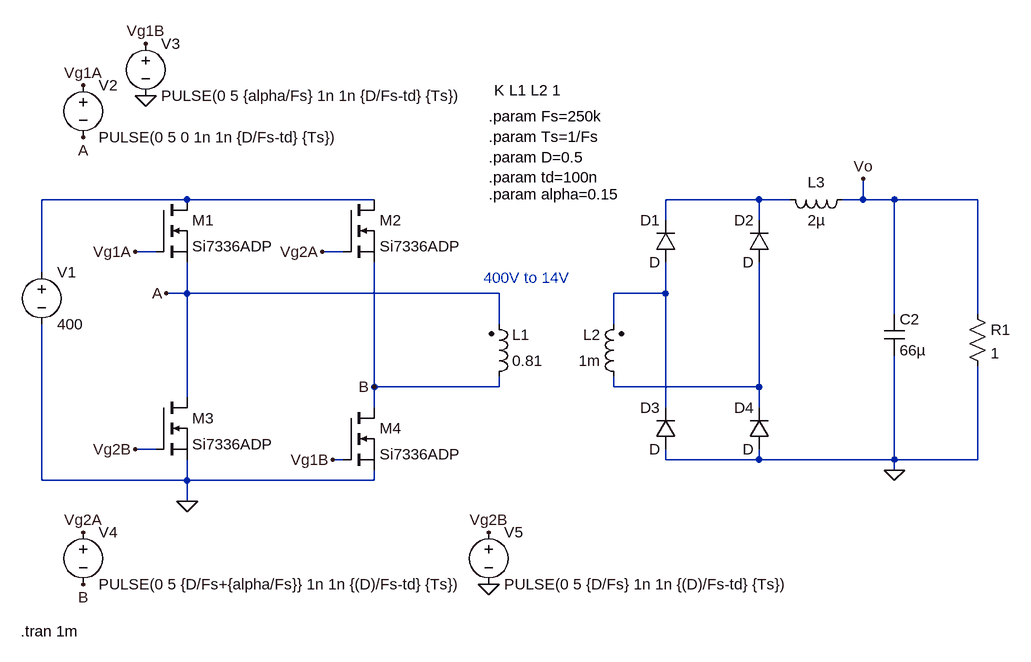
[diagram p0: schematic PSFB.asc]
PSFB.asc, the LTspice schematic file:
Version 4
SHEET 1 1024 680
WIRE -464 -64 -688 -64
WIRE -176 -64 -464 -64
WIRE 416 -64 272 -64
WIRE 464 -64 416 -64
WIRE 576 -64 576 -96
WIRE 576 -64 544 -64
WIRE 624 -64 576 -64
WIRE 752 -64 624 -64
WIRE 272 -32 272 -64
WIRE 416 -32 416 -64
WIRE -512 16 -544 16
WIRE -224 16 -256 16
WIRE -688 48 -688 -64
WIRE -464 80 -464 32
WIRE -464 80 -496 80
WIRE 16 80 -464 80
WIRE 272 80 272 32
WIRE 272 80 192 80
WIRE 624 112 624 -64
WIRE 752 112 752 -64
WIRE 16 128 16 80
WIRE 192 128 192 80
WIRE -176 224 -176 32
WIRE 16 224 16 208
WIRE 16 224 -176 224
WIRE 192 224 192 208
WIRE 416 224 416 32
WIRE 416 224 192 224
WIRE -464 240 -464 80
WIRE -176 256 -176 224
WIRE 272 256 272 80
WIRE 416 256 416 224
WIRE -512 320 -544 320
WIRE -224 336 -240 336
WIRE 272 336 272 320
WIRE 416 336 416 320
WIRE 416 336 272 336
WIRE 624 336 624 176
WIRE 624 336 416 336
WIRE 752 336 752 192
WIRE 752 336 624 336
WIRE 624 352 624 336
WIRE -688 368 -688 128
WIRE -464 368 -464 336
WIRE -464 368 -688 368
WIRE -176 368 -176 352
WIRE -176 368 -464 368
WIRE -464 400 -464 368
FLAG 576 -96 Vo
FLAG 624 352 0
FLAG -496 80 A
FLAG -176 224 B
FLAG -544 16 Vg1A
FLAG -240 336 Vg1B
FLAG -256 16 Vg2A
FLAG -544 320 Vg2B
FLAG -464 400 0
FLAG -624 -240 Vg1A
FLAG -624 -160 A
FLAG -528 -304 Vg1B
FLAG -528 -224 0
FLAG -624 448 Vg2A
FLAG -624 528 B
FLAG 0 448 Vg2B
FLAG 0 528 0
SYMBOL voltage -688 32 R0
SYMATTR InstName V1
SYMATTR Value 400
SYMBOL nmos -512 -64 R0
SYMATTR InstName M1
SYMATTR Value Si7336ADP
SYMBOL nmos -224 -64 R0
SYMATTR InstName M2
SYMATTR Value Si7336ADP
SYMBOL ind2 0 224 M180
WINDOW 0 36 80 Left 2
WINDOW 3 36 40 Left 2
SYMATTR InstName L1
SYMATTR Value 0.81
SYMATTR Type ind
SYMBOL ind2 208 224 R180
WINDOW 0 36 80 Left 2
WINDOW 3 36 40 Left 2
SYMATTR InstName L2
SYMATTR Value 1m
SYMATTR Type ind
SYMBOL nmos -512 240 R0
SYMATTR InstName M3
SYMATTR Value Si7336ADP
SYMBOL nmos -224 256 R0
SYMATTR InstName M4
SYMATTR Value Si7336ADP
SYMBOL diode 288 32 R180
WINDOW 0 24 64 Left 2
WINDOW 3 24 0 Left 2
SYMATTR InstName D1
SYMBOL diode 432 32 R180
WINDOW 0 24 64 Left 2
WINDOW 3 24 0 Left 2
SYMATTR InstName D2
SYMBOL diode 288 320 R180
WINDOW 0 24 64 Left 2
WINDOW 3 24 0 Left 2
SYMATTR InstName D3
SYMBOL diode 432 320 R180
WINDOW 0 24 64 Left 2
WINDOW 3 24 0 Left 2
SYMATTR InstName D4
SYMBOL cap 608 112 R0
SYMATTR InstName C2
SYMATTR Value 66µ
SYMBOL res 736 96 R0
SYMATTR InstName R1
SYMATTR Value 1
SYMBOL voltage -624 -256 R0
WINDOW 123 0 0 Left 0
WINDOW 39 0 0 Left 0
SYMATTR InstName V2
SYMATTR Value PULSE(0 5 0 1n 1n {D/Fs-td} {Ts})
SYMBOL voltage -528 -320 R0
WINDOW 123 0 0 Left 0
WINDOW 39 0 0 Left 0
SYMATTR InstName V3
SYMATTR Value PULSE(0 5 {alpha/Fs} 1n 1n {D/Fs-td} {Ts})
SYMBOL voltage -624 432 R0
WINDOW 123 0 0 Left 0
WINDOW 39 0 0 Left 0
SYMATTR InstName V4
SYMATTR Value PULSE(0 5 {D/Fs+{alpha/Fs}} 1n 1n {(D)/Fs-td} {Ts})
SYMBOL voltage 0 432 R0
WINDOW 123 0 0 Left 0
WINDOW 39 0 0 Left 0
SYMATTR InstName V5
SYMATTR Value PULSE(0 5 {D/Fs} 1n 1n {(D)/Fs-td} {Ts})
SYMBOL ind 560 -80 R90
WINDOW 0 5 56 VBottom 2
WINDOW 3 32 56 VTop 2
SYMATTR InstName L3
SYMATTR Value 2µ
TEXT -8 56 Left 2 ;400V to 14V
TEXT 0 -192 Left 2 !.param Fs=250k\n.param Ts=1/Fs\n.param D=0.5\n.param td=100n
TEXT -720 600 Left 2 !.tran 1m
TEXT 8 -232 Left 2 !K L1 L2 1
TEXT 0 -72 Left 2 !.param alpha=0.15

The netlist it stands for:
* PSFB.asc
V1 N001 0 400
M1 N001 Vg1A A A Si7336ADP
M2 N001 Vg2A B B Si7336ADP
L1 B A 0.81
L2 N004 N003 1m
M3 A Vg2B 0 0 Si7336ADP
M4 B Vg1B 0 0 Si7336ADP
D1 N003 N002 D
D2 N004 N002 D
D3 0 N003 D
D4 0 N004 D
C2 Vo 0 66µ
R1 Vo 0 1
V2 Vg1A A PULSE(0 5 0 1n 1n {D/Fs-td} {Ts})
V3 Vg1B 0 PULSE(0 5 {alpha/Fs} 1n 1n {D/Fs-td} {Ts})
V4 Vg2A B PULSE(0 5 {D/Fs+{alpha/Fs}} 1n 1n {(D)/Fs-td} {Ts})
V5 Vg2B 0 PULSE(0 5 {D/Fs} 1n 1n {(D)/Fs-td} {Ts})
L3 Vo N002 2µ
.model D D
.lib standard.dio
.model NMOS NMOS
.model PMOS PMOS
.lib standard.mos
* 400V to 14V
.param Fs=250k
.param Ts=1/Fs
.param D=0.5
.param td=100n
.tran 1m
K L1 L2 1
.param alpha=0.15
.backanno
.end